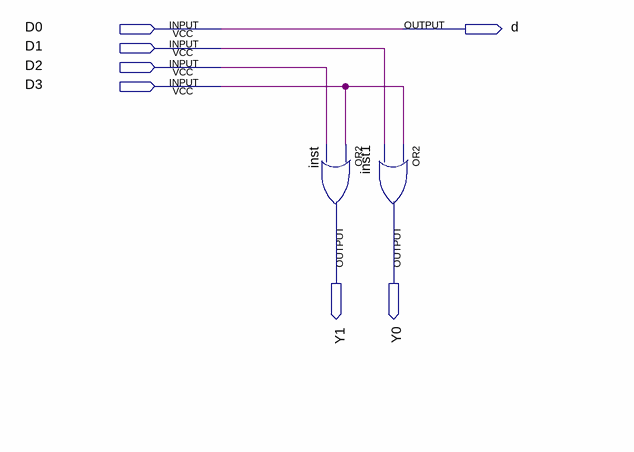
[diagram p0: schematic sheet]
// Quartus schematic 4t2encoder.bdf as structural Verilog: 2 symbols, 7 pins
module \4t2encoder  (
  input  D0,
  input  D1,
  input  D2,
  input  D3,
  output d,
  output Y1,
  output Y0
);

  or inst (Y1, D3, D2);
  or inst1 (Y0, D3, D1);

  assign d = D0;
endmodule
